# EAGLE schematic transceiver (EAGLE 6.4)
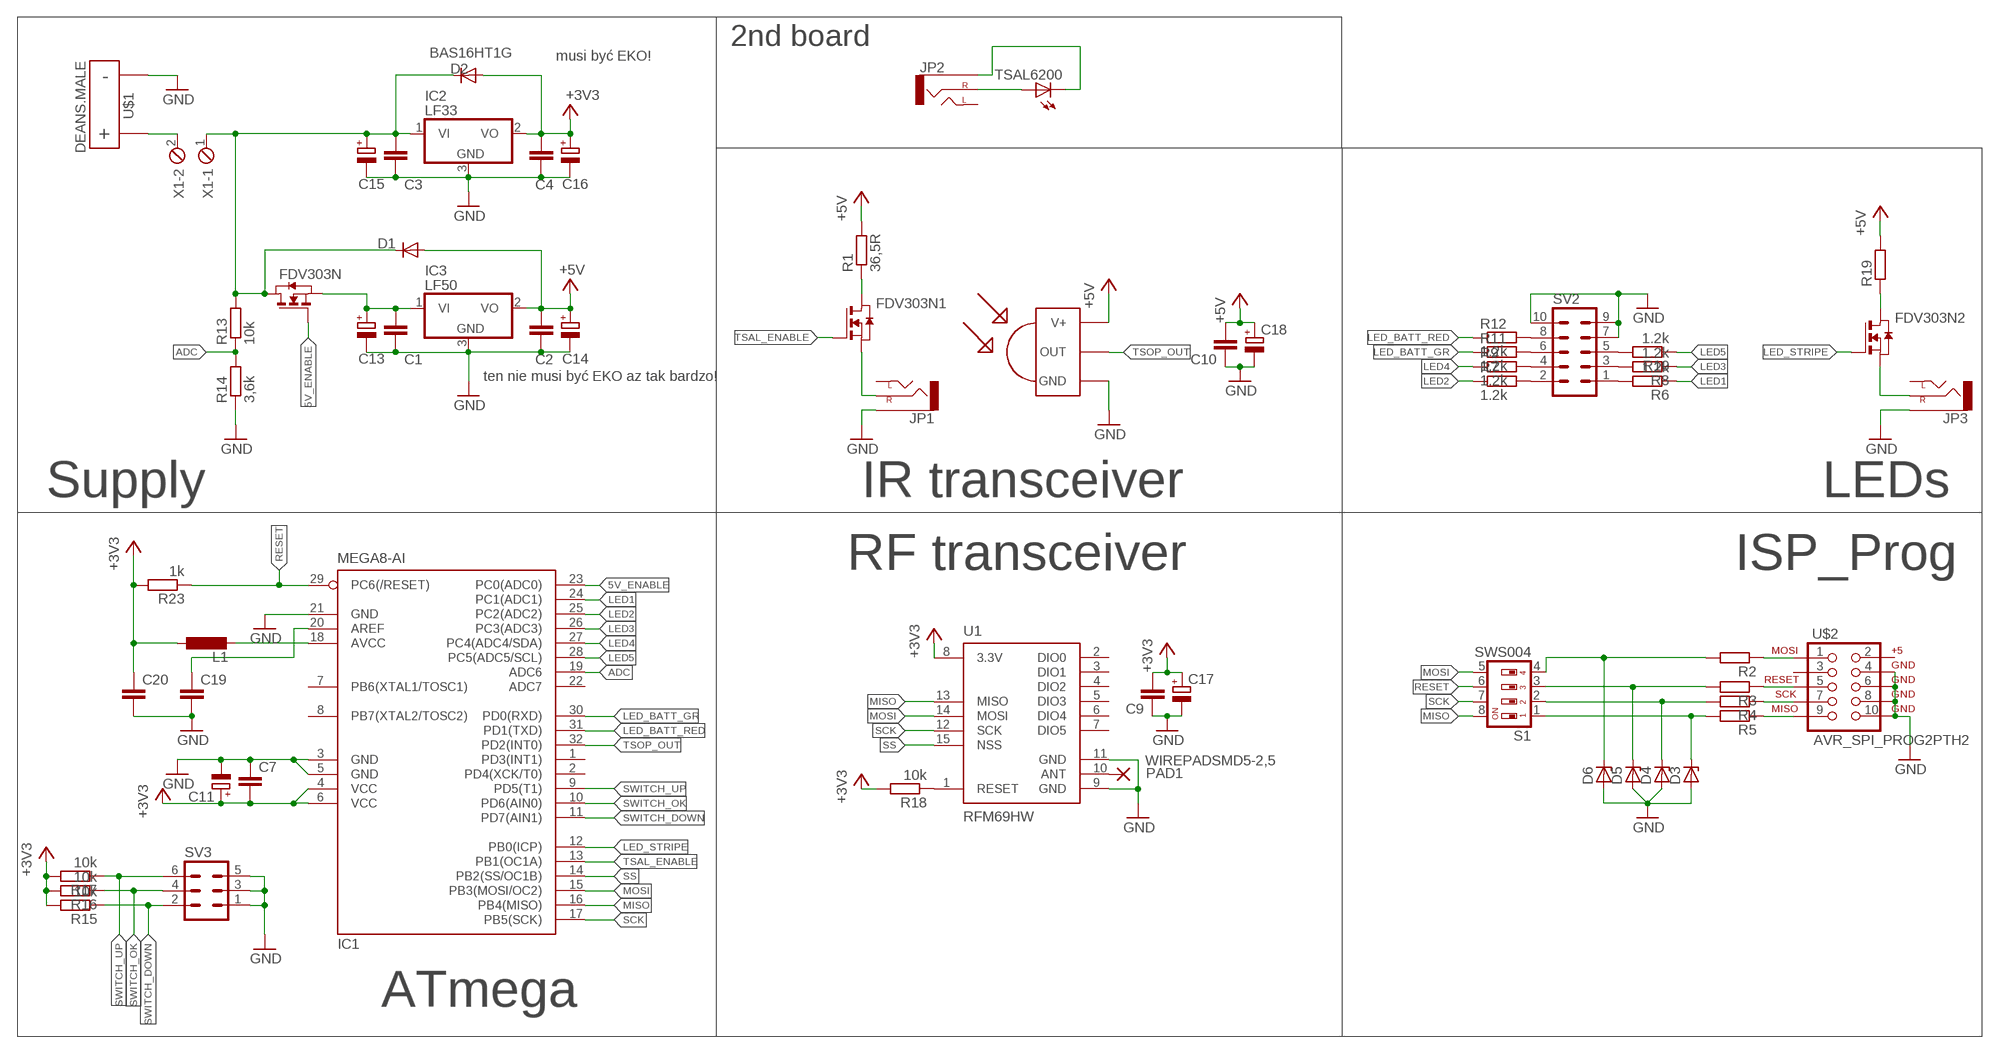
[diagram p0: schematic, sheet 1]

## Parts
C1  C-EUC0805  [C0805]
C2  C-EUC0805  [C0805]
C3  C-EUC0805  [C0805]
C4  C-EUC0805  [C0805]
C7  C-EUC0805  [C0805]
C9  C-EUC0805  [C0805]
C10  C-EUC0805  [C0805]
C11  CPOL-EUE2.5-5  [E2,5-5]
C13  CPOL-EUE2.5-5  [E2,5-5]
C14  CPOL-EUE2.5-5  [E2,5-5]
C15  CPOL-EUE2.5-5  [E2,5-5]
C16  CPOL-EUE2.5-5  [E2,5-5]
C17  CPOL-EUE2.5-5  [E2,5-5]
C18  CPOL-EUE2.5-5  [E2,5-5]
C19  C-EUC0805  [C0805]
C20  C-EUC0805  [C0805]
D1  BAS16HT1G  DIODESOD  [SOD-323]
D2  BAS16HT1G  DIODESOD  [SOD-323]
D3  ZENER-DIODESOD80C  [SOD80C]
D4  ZENER-DIODESOD80C  [SOD80C]
D5  ZENER-DIODESOD80C  [SOD80C]
D6  ZENER-DIODESOD80C  [SOD80C]
FDV303N  NMOSSOT23  [SOT-23]
FDV303N1  NMOSSOT23  [SOT-23]
FDV303N2  NMOSSOT23  [SOT-23]
IC1  MEGA8-AI  [TQFP32-08]
IC2  LF33  7805DT  [TO252]
IC3  LF50  7805DT  [TO252]
JP1  AUDIO-JACKPTH  [AUDIO-JACK]
JP2  AUDIO-JACKPTH  [AUDIO-JACK]
JP3  AUDIO-JACKPTH  [AUDIO-JACK]
L1  L-EU0204V  [0204V]
PAD1  WIREPADSMD5-2,5  [5-2,5]
R1  36,5R  R-EU_R0805  [R0805]
R2  R-EU_R0805  [R0805]
R3  R-EU_R0805  [R0805]
R4  R-EU_R0805  [R0805]
R5  R-EU_R0805  [R0805]
R6  1.2k  R-EU_R0805  [R0805]
R7  1.2k  R-EU_R0805  [R0805]
R8  1.2k  R-EU_R0805  [R0805]
R9  1.2k  R-EU_R0805  [R0805]
R10  1.2k  R-EU_R0805  [R0805]
R11  1,2k  R-EU_R0805  [R0805]
R12  1.2k  R-EU_R0805  [R0805]
R13  10k  R-EU_R0805  [R0805]
R14  3,6k  R-EU_R0805  [R0805]
R15  10k  R-EU_R0805  [R0805]
R16  10k  R-EU_R0805  [R0805]
R17  10k  R-EU_R0805  [R0805]
R18  10k  R-EU_R0805  [R0805]
R19  R-EU_R0805  [R0805]
R23  1k  R-EU_R0805  [R0805]
S1  SWS004  [SMS-004]
SV2  ML10  [ML10]
SV3  ML6  [ML6]
TSAL6200  LED5MM  [LED5MM]
TSOP  TSOP4836  [TSOP18XX]
U1  RFM69HW  [RFM69W-XXXS2]
U$1  DEANS.MALE  [DEANSM]
U$2  AVR_SPI_PROG2PTH2  [2X5-SHROUDED]
X1  MPT2  [2POL254]

## Nets
5V_ENABLE: FDV303N.3(G) IC1.23(PC0(ADC0))
$1S1: C1.2 C2.2 C3.2 C4.2 C7.1 C9.1 C10.1 C11.- C13.- C14.- C15.- C16.- C17.- C18.- C19.2 C20.2 D3.A D4.A D5.A D6.A IC1.3(GND) IC1.5(GND) IC1.21(GND) IC2.3(GND) IC3.3(GND) JP1.SLEEVE JP3.SLEEVE R14.1 SV2.7 SV2.9 SV2.10 SV3.1 SV3.3 SV3.5 TSOP.GND U1.9(GND) U1.11(GND) U$1.P$NEG U$2.4 U$2.6 U$2.8 U$2.10 ; supply symbol labelled GND
+3V3: C4.1 C7.2 C9.2 C11.+ C16.+ C17.+ C20.1 D2.2(A) IC1.4(VCC) IC1.6(VCC) IC2.2(VO) L1.1 R15.2 R16.2 R17.2 R18.2 R23.2 U1.8(3.3V)
+5V: C2.1 C10.2 C14.+ C18.+ D1.2(A) IC3.2(VO) R1.2 R19.2 TSOP.VCC(V+)
ADC: IC1.19(ADC6) R13.1 R14.2
LED1: IC1.24(PC1(ADC1)) R6.1
LED2: IC1.25(PC2(ADC2)) R7.1
LED3: IC1.26(PC3(ADC3)) R8.1
LED4: IC1.27(PC4(ADC4/SDA)) R9.1
LED5: IC1.28(PC5(ADC5/SCL)) R10.1
LED_BATT_GR: IC1.30(PD0(RXD)) R11.1
LED_BATT_RED: IC1.31(PD1(TXD)) R12.1
LED_STRIPE: FDV303N2.3(G) IC1.12(PB0(ICP))
MISO: IC1.16(PB4(MISO)) S1.8 U1.13(MISO)
MOSI: IC1.15(PB3(MOSI/OC2)) S1.5 U1.14(MOSI)
N$1: C1.1 C13.+ FDV303N.2(S) IC3.1(VI)
N$2: IC1.18(AVCC) L1.2
N$3: JP2.RING(RIGHT) TSAL6200.A
N$4: R2.1 U$2.1
N$5: R3.1 U$2.5
N$6: R4.1 U$2.7
N$7: R5.1 U$2.9
N$8: FDV303N1.1(D) R1.1
N$9: R6.2 SV2.1
N$10: R7.2 SV2.2
N$11: R8.2 SV2.3
N$12: R9.2 SV2.4
N$13: R10.2 SV2.5
N$16: R11.2 SV2.6
N$17: R12.2 SV2.8
N$19: U$1.P$POS X1.2
N$21: R18.1 U1.1(RESET)
N$22: JP2.SLEEVE TSAL6200.K(C)
N$23: FDV303N1.2(S) JP1.RING(RIGHT)
N$24: FDV303N2.2(S) JP3.RING(RIGHT)
N$25: FDV303N2.1(D) R19.1
N$26: C19.1 IC1.20(AREF)
N$27: C3.1 C15.+ D1.1(C) D2.1(C) FDV303N.1(D) IC2.1(VI) R13.2 X1.1
N$28: PAD1.1(P) U1.10(ANT)
N$29: D6.C R2.2 S1.4
N$30: D5.C R3.2 S1.3
N$31: D4.C R4.2 S1.2
N$32: D3.C R5.2 S1.1
RESET: IC1.29(PC6(/RESET)) R23.1 S1.6
SCK: IC1.17(PB5(SCK)) S1.7 U1.12(SCK)
SS: IC1.14(PB2(SS/OC1B)) U1.15(NSS)
SWITCH_DOWN: IC1.11(PD7(AIN1)) R15.1 SV3.2
SWITCH_OK: IC1.10(PD6(AIN0)) R16.1 SV3.4
SWITCH_UP: IC1.9(PD5(T1)) R17.1 SV3.6
TSAL_ENABLE: FDV303N1.3(G) IC1.13(PB1(OC1A))
TSOP_OUT: IC1.32(PD2(INT0)) TSOP.OUT
Unconnected: IC1.1(PD3(INT1)) IC1.2(PD4(XCK/T0)) IC1.7(PB6(XTAL1/TOSC1)) IC1.8(PB7(XTAL2/TOSC2)) IC1.22(ADC7) JP1.TIP(LEFT) JP2.TIP(LEFT) JP3.TIP(LEFT) U1.2(DIO0) U1.3(DIO1) U1.4(DIO2) U1.5(DIO3) U1.6(DIO4) U1.7(DIO5) U$2.2 U$2.3

## Notes on the sheet
- 2nd board
- musi być EKO!
- ten nie musi być EKO az tak bardzo!
- Supply | IR transceiver | LEDs
- RF transceiver | ISP_Prog
- ATmega

## Library data of the parts
C1-C4 C7 C9 C10 C19 C20 = resistor:C-EU: CAPACITOR, European symbol
C11 C13-C18 = rcl:CPOL-EU: POLARIZED CAPACITOR, European symbol
D1 D2 = SparkFun:DIODE: Diode These are standard reverse protection diodes and small signal diodes. SMA package can handle up to about 1A. SOD-323 can handle about 200mA. What the SOD-323 package when ordering, there are some mfgs out there that are 5-pin packages.
D3-D6 = diode:ZENER-DIODE: Z-Diode
FDV303N FDV303N1 FDV303N2 = zetex:NMOSSOT23: MOS FET; OC_FARNELL: unknown; OC_NEWARK: unknown
IC1 = atmel:MEGA8: MICROCONTROLLER 8 Kbytes FLASH, 1 kbytes SRAM, 512 bytes EEPROM, USART, 6-channel 10 bit ADC, 2-channel 8 bit ADC Pin compatible with Atmega48, ATMega88, ATMega168 Source: avr.lbr; MPN: ATMEGA8-16AU; OC_FARNELL: 9171371; OC_NEWARK: 73M8863
IC2 IC3 = linear:78*: Positive VOLTAGE REGULATOR Source: http://cache.national.com/ds/LM/LM78L05.pdf http://www.fairchildsemi.com/ds/LM/LM7805.pdf
JP1-JP3 = SparkFun-Connectors:AUDIO-JACK: 3.5mm Audio Jack Simple 3.5mm common PCB mount audio jack. SKU: PRT-08032
L1 = resistor:L-EU: INDUCTOR, European symbol
PAD1 = wirepad:WIREPAD: Wire PAD connect wire on PCB
R1-R19 R23 = resistor:R-EU_: RESISTOR, European symbol
S1 = smd-special:SWS004: SMD Dip Switch 4 pol.
SV2 = con-harting-ml:ML10: HARTING; OC_FARNELL: unknown; OC_NEWARK: unknown
SV3 = con-harting-ml:ML6: HARTING; OC_FARNELL: unknown; OC_NEWARK: unknown
TSAL6200 = led:LED: LED OSRAM: - CHIPLED LG R971, LG N971, LY N971, LG Q971, LY Q971, LO R971, LY R971 LH N974, LH R974 LS Q976, LO Q976, LY Q976 LO Q996 - Hyper CHIPLED LW Q18S LB Q993, LB Q99A, LB R99A - SideLED LS A670, LO A670, LY A670, LG A670, LP A670 LB A673, LV A673, LT A673, LW A673 LH A674 LY A675 LS A676, LA A676, LO A676, LY A676, LW A676 LS A679, LY A679, LG A679 - Hyper Micro SIDELED® LS Y876, LA Y876, LO Y876, LY Y876 LT Y87S - SmartLED LW L88C, LW L88S LB L89C, LB L89S, LG L890 LS L89K, LO L89K, LY L89K LS L896, LA L896, LO L896, LY L896 - TOPLED LS T670, LO T670, LY T670, LG T670, LP T670 LSG T670, LSP T670, LSY T670, LOP T670, LYG T670 LG T671, LOG T671, LSG T671 LB T673, LV T673, LT T673, LW T673 LH T674 LS T676, LA T676, LO T676, LY T676, LB T676, LH T676, LSB T676, LW T676 LB T67C, LV T67C, LT T67C, LS T67K, LO T67K, LY T67K, LW E67C LS E67B, LA E67B, LO E67B, LY E67B, LB E67C, LV E67C, LT E67C LW T67C LS T679, LY T679, LG T679 LS T770, LO T770, LY T770, LG T770, LP T770 LB T773, LV T773, LT T773, LW T773 LH T774 LS E675, LA E675, LY E675, LS T675 LS T776, LA T776, LO T776, LY T776, LB T776 LHGB T686 LT T68C, LB T68C - Hyper Mini TOPLED® LB M676 - Mini TOPLED Santana® LG M470 LS M47K, LO M47K, LY M47K Source: http://www.osram.convergy.de LUXEON: - LUMILED® LXK2-PW12-R00, LXK2-PW12-S00, LXK2-PW14-U00, LXK2-PW14-V00 LXK2-PM12-R00, LXK2-PM12-S00, LXK2-PM14-U00 LXK2-PE12-Q00, LXK2-PE12-R00, LXK2-PE12-S00, LXK2-PE14-T00, LXK2-PE14-U00 LXK2-PB12-K00, LXK2-PB12-L00, LXK2-PB12-M00, LXK2-PB14-N00, LXK2-PB14-P00, LXK2-PB14-Q00 LXK2-PR12-L00, LXK2-PR12-M00, LXK2-PR14-Q00, LXK2-PR14-R00 LXK2-PD12-Q00, LXK2-PD12-R00, LXK2-PD12-S00 LXK2-PH12-R00, LXK2-PH12-S00 LXK2-PL12-P00, LXK2-PL12-Q00, LXK2-PL12-R00 Source: www.luxeon.com KINGBRIGHT: KA-3528ASYC Source: www.kingbright.com
TSOP = tsop:TSOP4836: IR Receiver and Demodulator
U1 = SparkFun-RF:RFM69H
U$1 = bt_electromech:DEANS
U$2 = SparkFun:AVR_SPI_PROG2: AVR ICSP Header This is the standard AVR In Circuit Serial Programming header. Minimal, but includes pin one indicator. Works with standard Olimex programmers. Also look for the 6-pin reduced version. Spark Fun Electronics SKU: PRT-00778
X1 = con-phoenix-254:MPT2: PHOENIX CONNECTOR; OC_FARNELL: unknown; OC_NEWARK: unknown